# EAGLE design rpi_ad7705 (EAGLE 6.2)
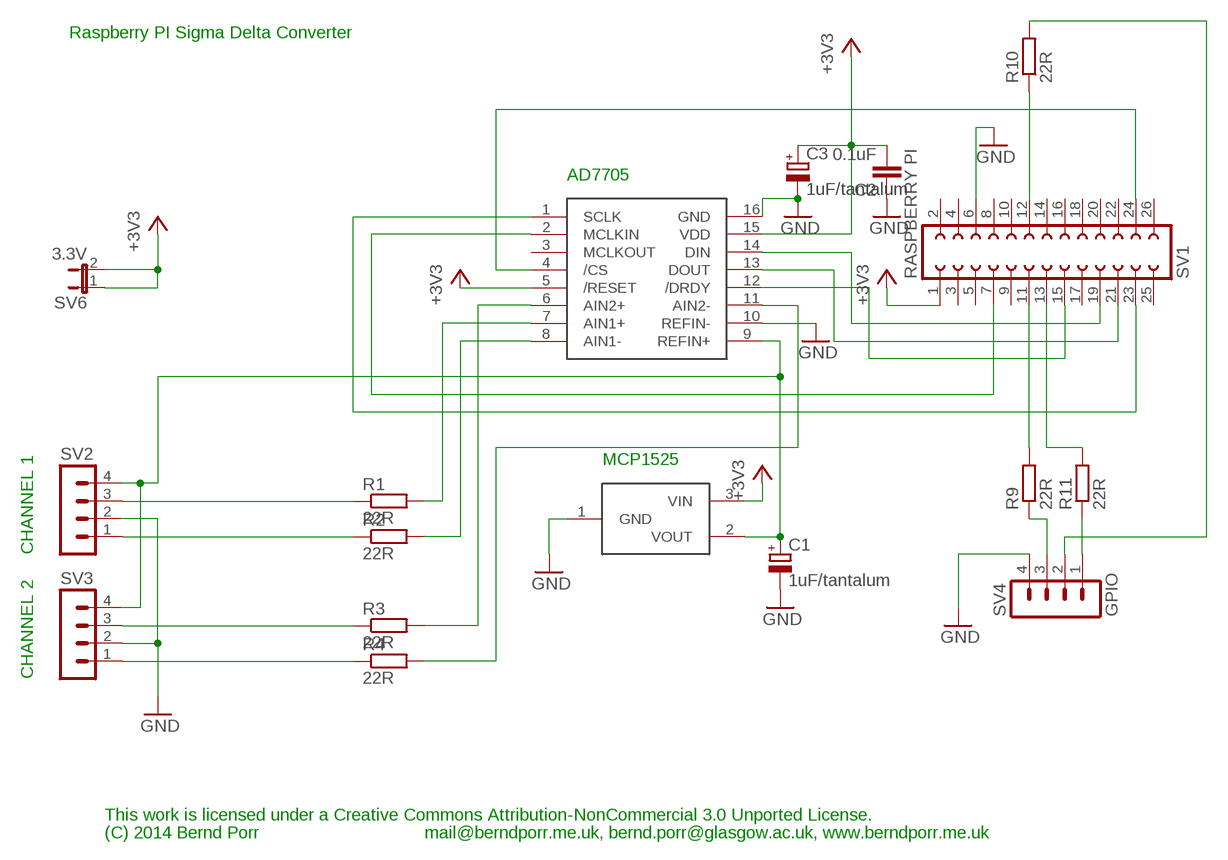
[diagram p0: schematic, sheet 1]

## Parts
C1  1uF/tantalum  CPOL-EUTT2D7  [TT2D7]
C2  0.1uF  C5/2.5  [C5B2.5]
C3  1uF/tantalum  CPOL-EUTT2D7  [TT2D7]
R1  22R  R-EU_0207/10  [0207/10]
R2  22R  R-EU_0207/10  [0207/10]
R3  22R  R-EU_0207/10  [0207/10]
R4  22R  R-EU_0207/10  [0207/10]
R9  22R  R-EU_0207/10  [0207/10]
R10  22R  R-EU_0207/10  [0207/10]
R11  22R  R-EU_0207/10  [0207/10]
SV1  RASPBERRY PI  FE13-2  [FE13-2]
SV2  MA04-1  [MA04-1]
SV3  MA04-1  [MA04-1]
SV4  GPIO  MA04-1  [MA04-1]
SV6  3.3V  JP1E  [JP1]
U$1  AD7705  [DIP16]
U$2  MCP1525  [TO92]

## Nets
+3V3: C2.2 C3.+ SV1.1 SV6.1 SV6.2 U$1.5(/RESET) U$1.15(VDD) U$2.3(VIN)
GND: C1.- C2.1 C3.- SV1.6 SV2.2 SV3.2 SV4.4 U$1.10(REFIN-) U$1.16(GND) U$2.1(GND)
N$1: SV1.19 U$1.14(DIN)
N$2: SV1.23 U$1.1(SCLK)
N$3: SV1.7 U$1.2(MCLKIN)
N$4: SV1.24 U$1.4(/CS)
N$5: C1.+ SV2.4 SV3.4 U$1.9(REFIN+) U$2.2(VOUT)
N$6: SV1.21 U$1.13(DOUT)
N$7: R2.2 U$1.8(AIN1-)
N$8: R1.2 U$1.7(AIN1+)
N$9: R3.2 U$1.6(AIN2+)
N$10: R4.2 U$1.11(AIN2-)
N$11: R1.1 SV2.3
N$12: R2.1 SV2.1
N$13: R3.1 SV3.3
N$14: R4.1 SV3.1
N$15: R9.2 SV1.11
N$16: R10.1 SV1.12
N$17: R11.2 SV1.13
N$18: R9.1 SV4.3
N$19: R11.1 SV4.1
N$20: R10.2 SV4.2
N$21: SV1.15 U$1.12(/DRDY)
Unconnected: SV1.2 SV1.3 SV1.4 SV1.5 SV1.8 SV1.9 SV1.10 SV1.14 SV1.16 SV1.17 SV1.18 SV1.20 SV1.22 SV1.25 SV1.26 U$1.3(MCLKOUT)

## Notes on the sheet
- Raspberry PI Sigma Delta Converter
- AD7705
- MCP1525
- CHANNEL 1
- CHANNEL 2
- This work is licensed under a Creative Commons Attribution-NonCommercial 3.0 Unported License.
- (C) 2014 Bernd Porr | mail@berndporr.me.uk, bernd.porr@glasgow.ac.uk, www.berndporr.me.uk

## Library data of the parts
C1 C3 = rcl:CPOL-EU: POLARIZED CAPACITOR, European symbol
C2 = capacitor-wima:C: CAPACITOR naming: grid - package width
R1-R4 R9-R11 = resistor:R-EU_: RESISTOR, European symbol
SV1 = con-lsta:FE13-2: FEMALE HEADER; OC_FARNELL: unknown; OC_NEWARK: unknown
SV2-SV4 = con-lstb:MA04-1: PIN HEADER; OC_FARNELL: unknown; OC_NEWARK: unknown
SV6 = jumper:JP1E: JUMPER
U$1 = rpi:AD7705
U$2 = rpi:MCP1525

## Board
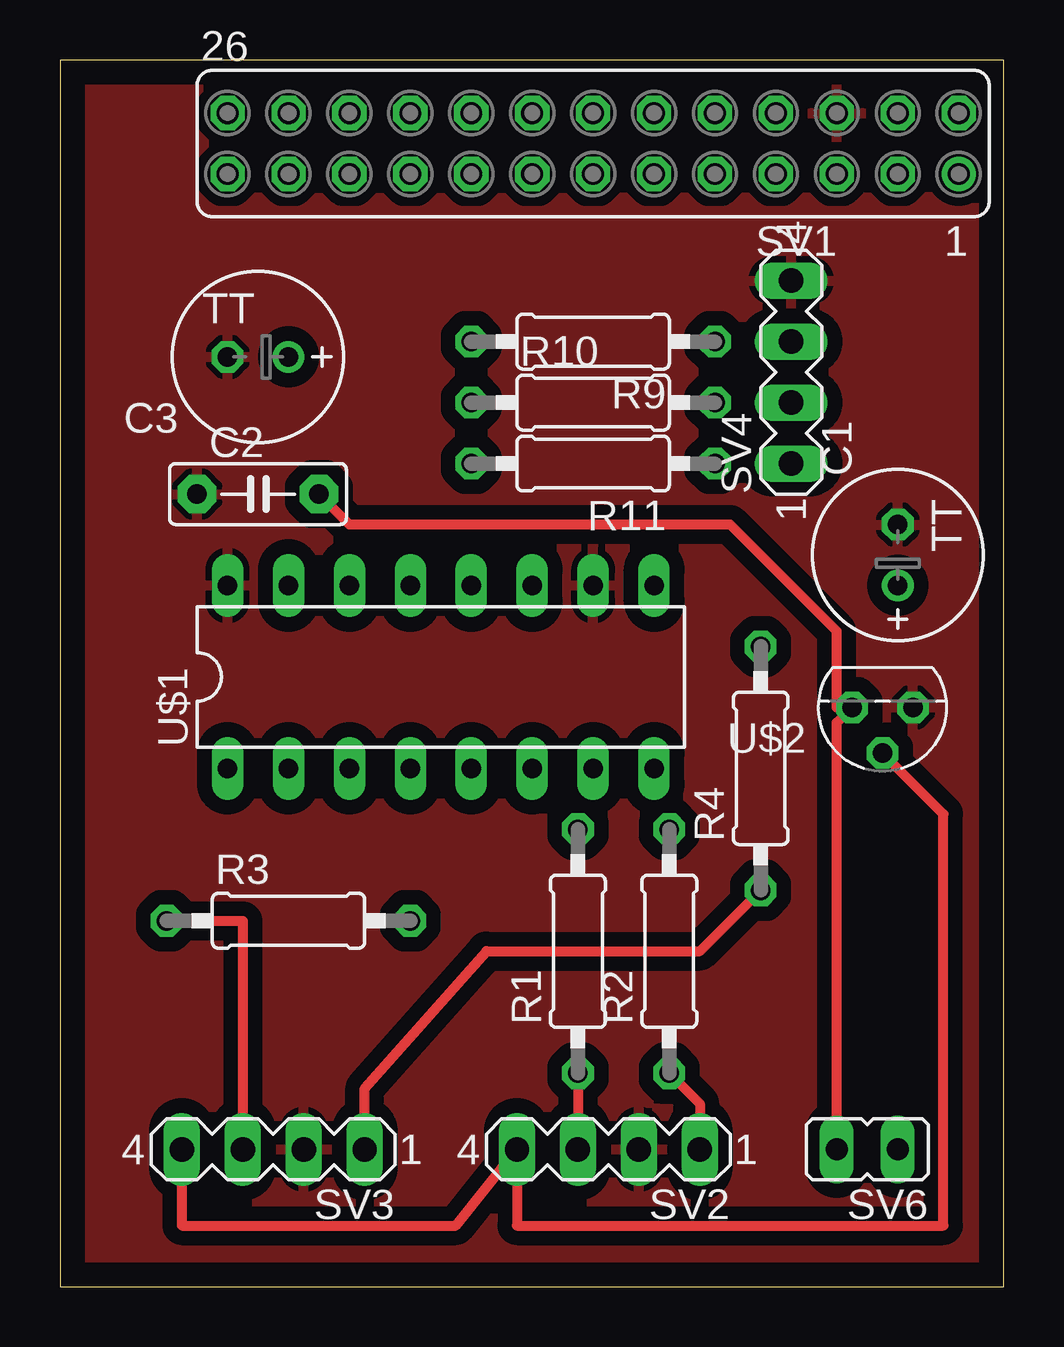
[diagram p1: board, top side]
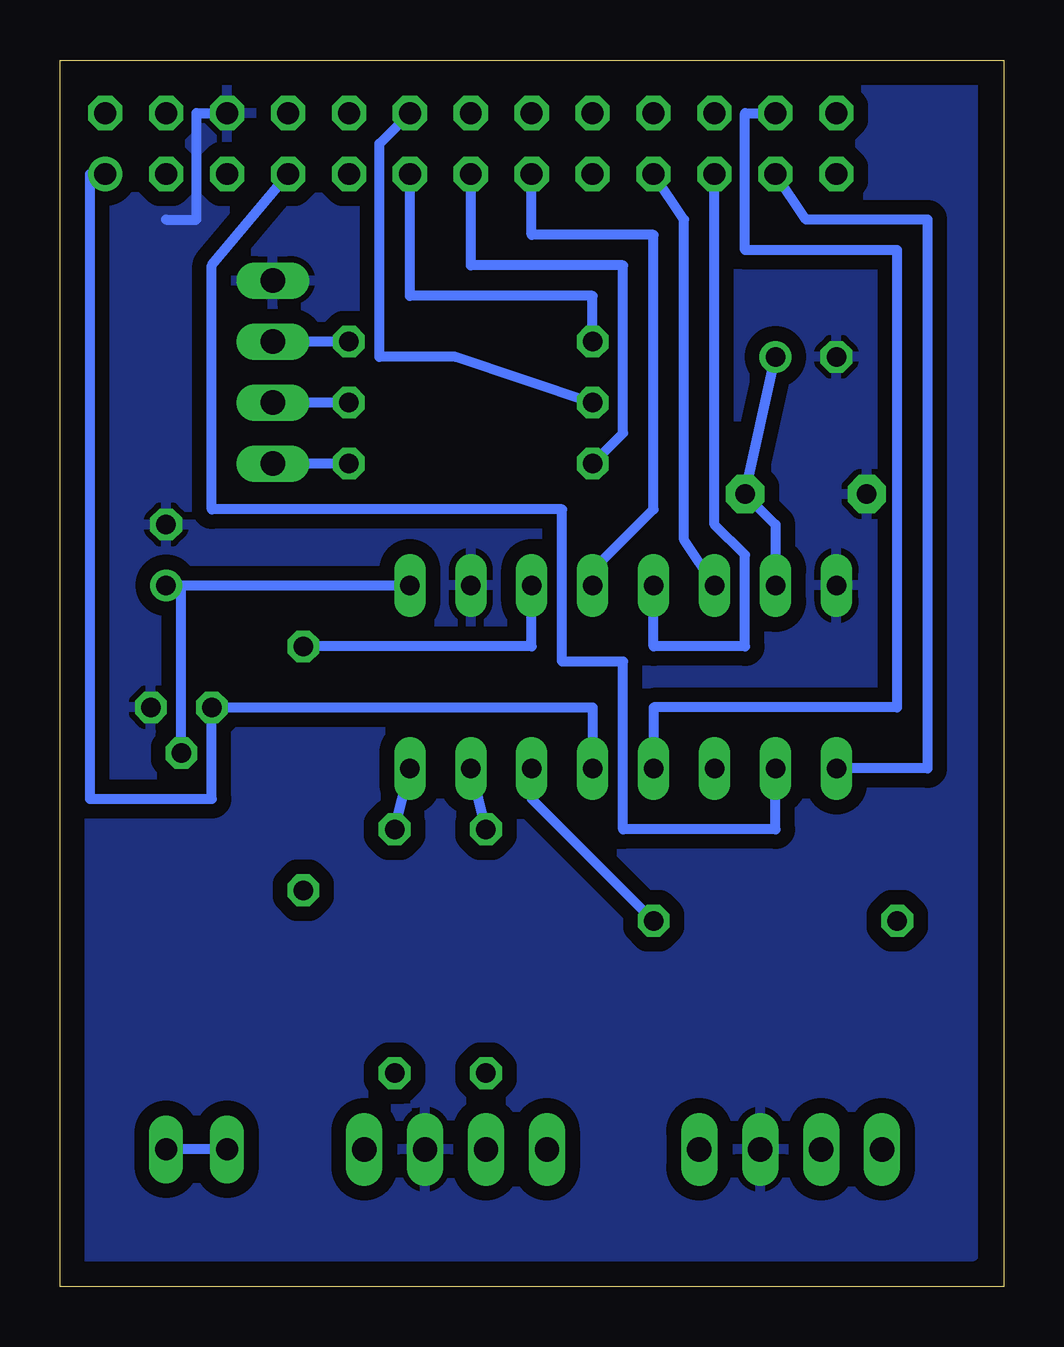
[diagram p2: board, bottom side, seen from below]

Size 39.35 x 51.1 mm. Coordinates in mm from the lower left corner, seen from the top.
Outline: 0,0 39.35,0 39.35,51.1 0,51.1 0,0
Copper layers (1*16): Top 0.035mm / dielectric 1.5mm / Bottom 0.035mm
Design rules: minimum track width 10mil, minimum drill 24mil, track to track 8mil, track to pad 8mil, pad to pad 8mil, via to via 8mil, smd to smd 8mil, copper to edge 40mil, drill to drill 8mil, minimum pad ring 10mil, minimum via ring 8mil, stop-mask expansion 4mil, vias tented up to drill 0mil, thermal gap 10mil

### Footprints (pad centres in the part's own frame; a part is rotated, then mirrored left to right if it is on the bottom)
TT2D7 = drill 0.813: + -1.27,0 | drill 0.813 octagon: - 1.27,0
C5B2.5 = drill 0.813 pad 1.6 octagon: 1 -2.54,0; 2 2.54,0
0207/10 = drill 0.813 octagon: 1 -5.08,0; 2 5.08,0
FE13-2 = drill 0.914: 1 -15.24,1.27 | drill 0.914 octagon: 2 -15.24,-1.27; 3 -12.7,1.27; 4 -12.7,-1.27; 5 -10.16,1.27; 6 -10.16,-1.27; 7 -7.62,1.27; 8 -7.62,-1.27; 9 -5.08,1.27; 10 -5.08,-1.27; 11 -2.54,1.27; 12 -2.54,-1.27; 13 0,1.27; 14 0,-1.27; 15 2.54,1.27; 16 2.54,-1.27; 17 5.08,1.27; 18 5.08,-1.27; 19 7.62,1.27; 20 7.62,-1.27; 21 10.16,1.27; 22 10.16,-1.27; 23 12.7,1.27; 24 12.7,-1.27; 25 15.24,1.27; 26 15.24,-1.27
MA04-1 = drill 1.016 long: 1 -3.81,0; 2 -1.27,0; 3 1.27,0; 4 3.81,0
JP1 = drill 0.914 long: 1 0,-1.27; 2 0,1.27
DIP16 = drill 0.813 long: 1 -8.89,-3.81; 2 -6.35,-3.81; 3 -3.81,-3.81; 4 -1.27,-3.81; 5 1.27,-3.81; 6 3.81,-3.81; 7 6.35,-3.81; 8 8.89,-3.81; 9 8.89,3.81; 10 6.35,3.81; 11 3.81,3.81; 12 1.27,3.81; 13 -1.27,3.81; 14 -3.81,3.81; 15 -6.35,3.81; 16 -8.89,3.81
TO92 = drill 0.813 octagon: 1 -3.81,0; 2 -2.54,1.905; 3 -1.27,0

### Placement (x,y rotation side)
C1  34.92,30.48 90 top
C2  8.26,33.02 0 top
C3  8.26,38.73 180 top
R1  21.59,13.97 90 top
R2  25.4,13.97 90 top
R3  9.53,15.24 0 top
R4  29.21,21.59 90 top
R9  22.23,39.37 180 top
R10  22.23,36.83 0 top
R11  22.23,34.29 180 top
SV1  22.23,47.62 180 top
SV2  22.86,5.71 180 top
SV3  8.89,5.71 180 top
SV4  30.48,38.1 90 top
SV6  33.66,5.71 90 top
U$1  15.88,25.4 0 top
U$2  31.75,24.13 180 top

### Tracks (layer width: path | path; a pad name or v marks a point on that pad's centre or on a via)
+3V3
  Top 0.406: C2.2 12.06,31.75 27.94,31.75 32.38,27.3 32.38,24.13 U$2.3 32.38,23.5 SV6.2
  Bottom 0.406: SV1.1 38.1,46.35 38.1,20.32 33.02,20.32 U$2.3 17.14,24.13 U$1.5 | C3.+ C2.2 9.53,31.75 U$1.15 | SV6.2 SV6.1
GND
  Bottom 0.406: SV1.6 33.66,48.9 33.66,44.45 34.92,44.45
  pour Bottom (isolate 0.61): 1.27,50.16 41.27,50.16 41.27,1.27 1.27,1.27
  pour Top (isolate 0.61): 1.27,50.16 41.27,50.16 41.27,0.64 1.27,0.64
N$1
  Bottom 0.406: U$1.14 13.34,31.11 13.34,44.45 SV1.19
N$2
  Bottom 0.406: U$1.1 3.17,21.59 3.17,44.45 8.26,44.45 SV1.23
N$3
  Bottom 0.406: U$1.2 9.53,19.05 15.88,19.05 15.88,26.04 18.41,26.04 18.41,32.38 33.02,32.38 33.02,42.55 SV1.7
N$4
  Bottom 0.406: SV1.24 10.79,48.9 10.79,43.18 4.45,43.18 4.45,24.13 14.61,24.13 U$1.4
N$5
  Top 0.406: SV3.4 5.08,2.54 16.51,2.54 SV2.4 19.05,2.54 36.83,2.54 36.83,19.68 U$2.2
  Bottom 0.406: 34.29,29.21 U$1.9 | U$2.2 34.29,29.21 | 34.29,29.21 C1.+
N$6
  Bottom 0.406: U$1.13 14.61,26.67 10.79,26.67 10.79,30.48 12.06,31.75 SV1.21
N$7
  Bottom 0.406: R2.2 U$1.8
N$8
  Bottom 0.406: R1.2 U$1.7
N$9
  Bottom 0.406: R3.2 19.68,20.32 U$1.6
N$10
  Bottom 0.406: R4.2 19.68,26.67 U$1.11
N$11
  Top 0.406: R1.1 SV2.3
N$12
  Top 0.406: R2.1 26.67,7.62 SV2.1
N$13
  Top 0.406: R3.1 7.62,15.24 SV3.3
N$14
  Top 0.406: SV3.1 12.7,8.26 17.78,13.97 26.67,13.97 R4.1
N$15
  Bottom 0.406: SV1.11 24.77,41.27 17.14,41.27 R9.2
N$16
  Bottom 0.406: SV1.12 26.04,47.62 26.04,38.73 22.86,38.73 R10.1
N$17
  Bottom 0.406: SV1.13 22.23,42.55 15.88,42.55 15.88,35.56 R11.2
N$18
  Bottom 0.406: R9.1 SV4.3
N$19
  Bottom 0.406: R11.1 SV4.1
N$20
  Bottom 0.406: R10.2 SV4.2
N$21
  Bottom 0.406: U$1.12 17.14,29.84 14.61,32.38 14.61,43.81 19.68,43.81 SV1.15